# EAGLE design nfc_lock (EAGLE 7.7.0)
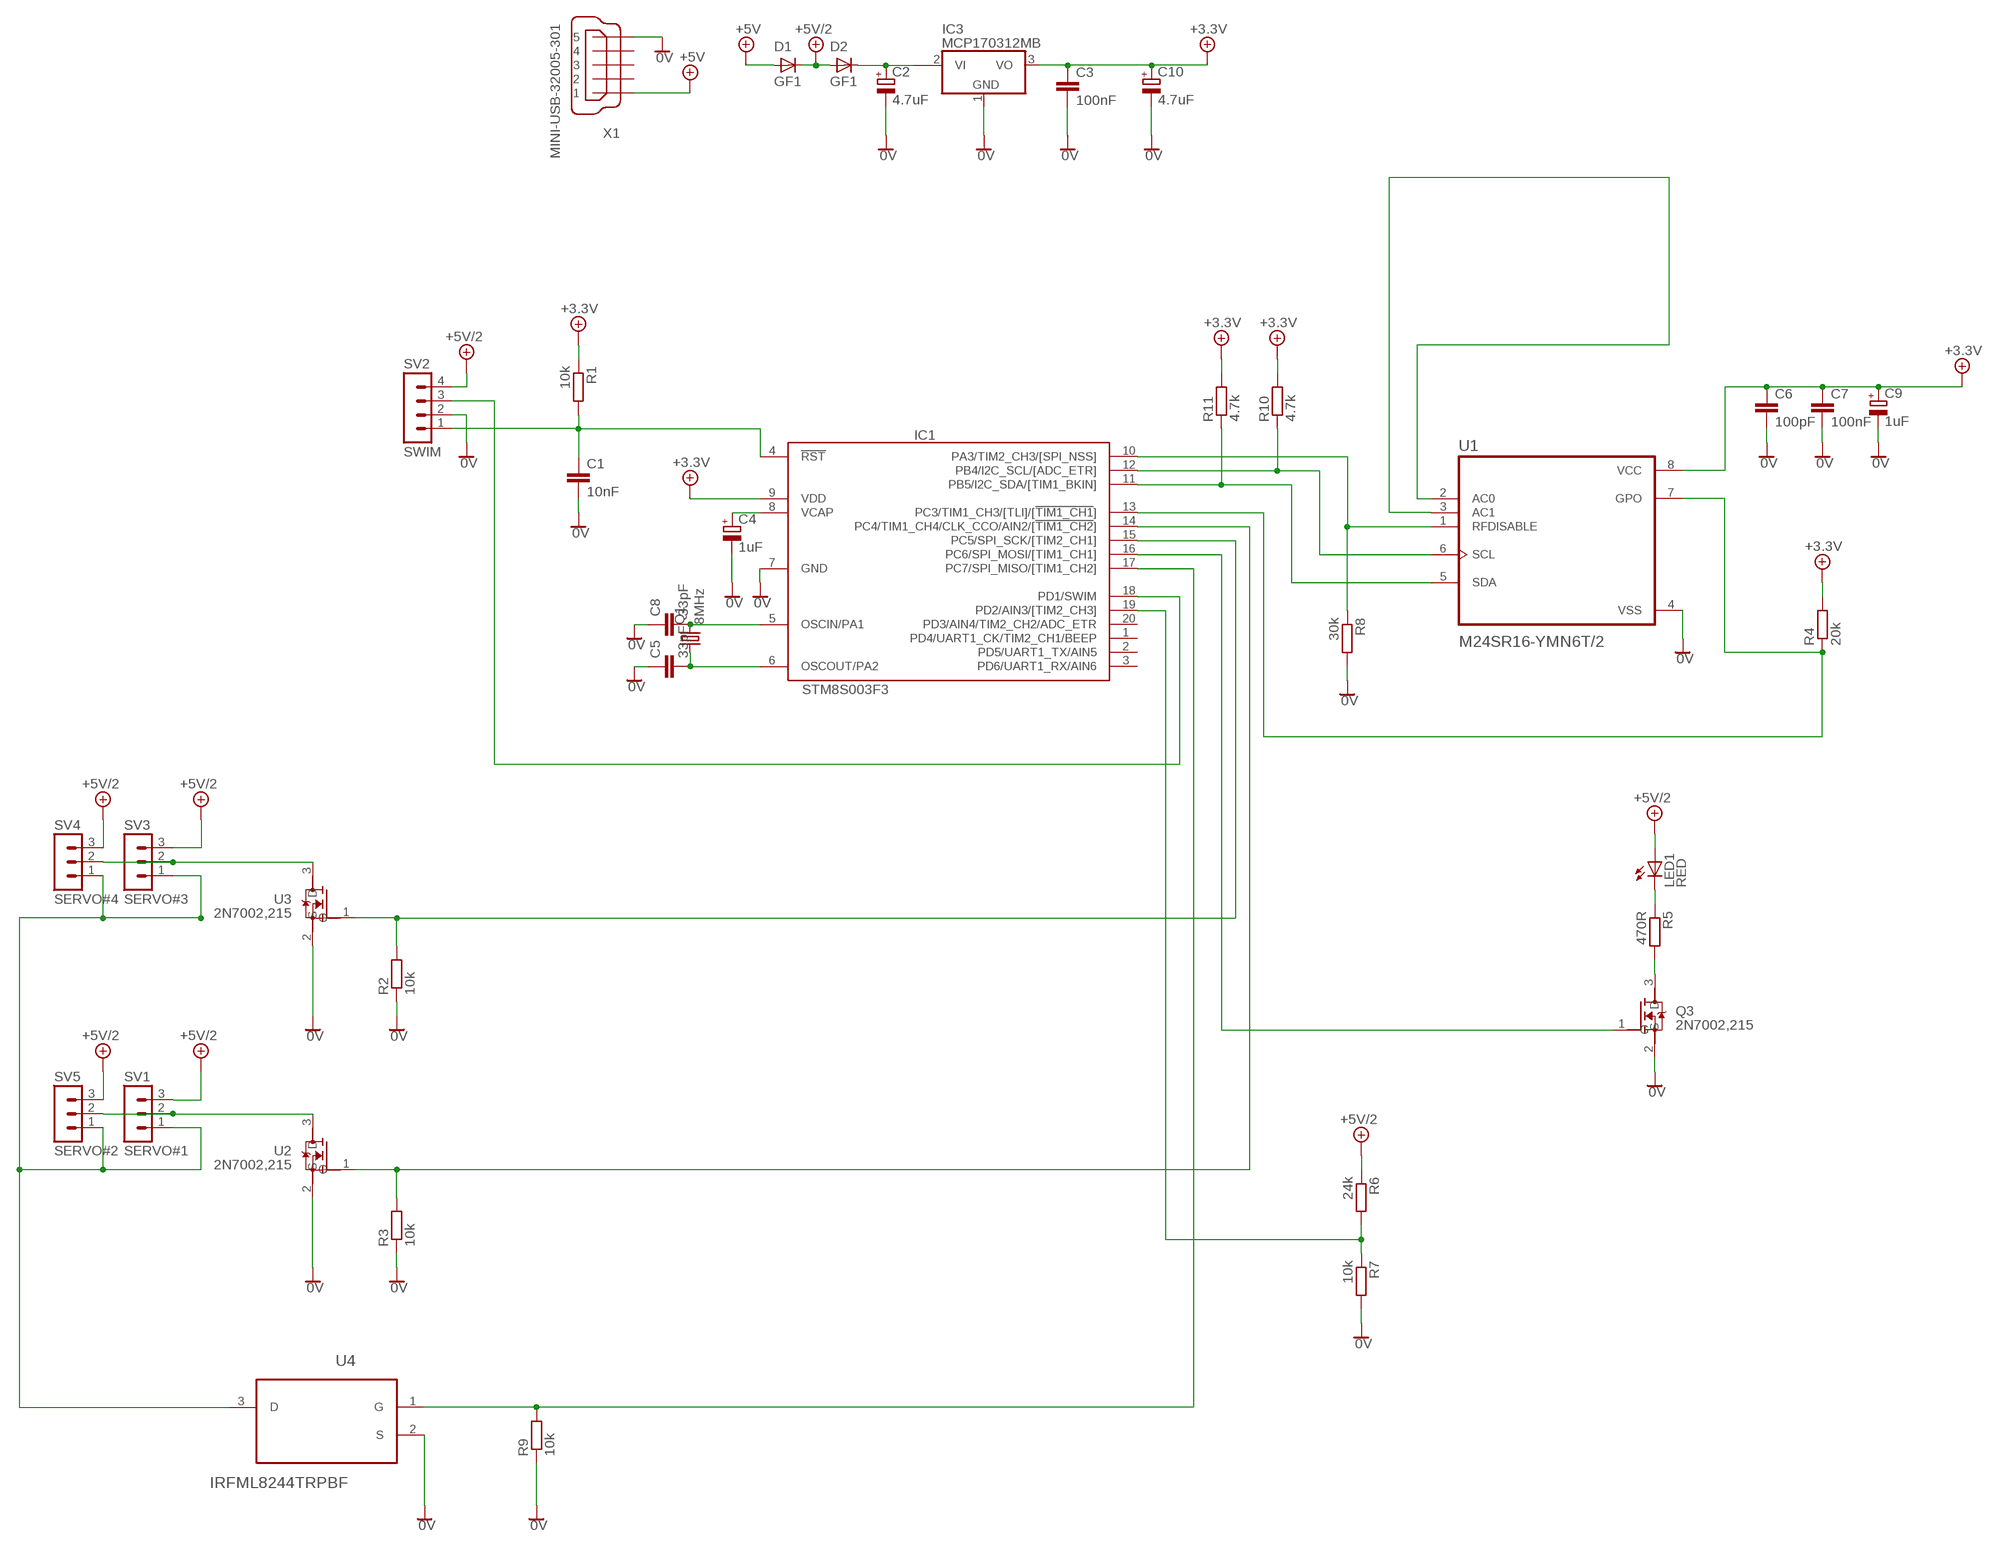
[diagram p0: schematic, sheet 1]

## Parts
C1  10nF  C-EUC0603K  [C0603K]
C2  4.7uF  CPOL-EU153CLV-0405  [153CLV-0405]
C3  100nF  C-EUC1206  [C1206]
C4  1uF  CPOL-EU153CLV-0405  [153CLV-0405]
C5  33pF  C-EUC0603K  [C0603K]
C6  100pF  C-EUC1206  [C1206]
C7  100nF  C-EUC1206  [C1206]
C8  33pF  C-EUC0603K  [C0603K]
C9  1uF  CPOL-EU153CLV-0405  [153CLV-0405]
C10  4.7uF  CPOL-EU153CLV-0405  [153CLV-0405]
D1  GF1  [SMA-DO214AC]
D2  GF1  [SMA-DO214AC]
IC1  STM8S003F3  [TSSOP20]
IC3  MCP170312MB  [SOT89]
LED1  RED  LEDCHIP-LED0603  [CHIP-LED0603]
Q1  8MHz  CRYSTALSM49  [SM49]
Q3  2N7002,215  [SOT95P230X110-3N]
R1  10k  R-EU_R0805  [R0805]
R2  10k  R-EU_R0805  [R0805]
R3  10k  R-EU_R0805  [R0805]
R4  20k  R-EU_R0805  [R0805]
R5  470R  R-EU_R0805  [R0805]
R6  24k  R-EU_R0805  [R0805]
R7  10k  R-EU_R0805  [R0805]
R8  30k  R-EU_R0805  [R0805]
R9  10k  R-EU_R0805  [R0805]
R10  4.7k  R-EU_R0805  [R0805]
R11  4.7k  R-EU_R0805  [R0805]
SV1  SERVO#1  MA03-1  [MA03-1]
SV2  SWIM  MA04-1  [MA04-1]
SV3  SERVO#3  MA03-1  [MA03-1]
SV4  SERVO#4  MA03-1  [MA03-1]
SV5  SERVO#2  MA03-1  [MA03-1]
U1  M24SR16-YMN6T/2  [SOIC127P600X175-8N]
U2  2N7002,215  [SOT95P230X110-3N]
U3  2N7002,215  [SOT95P230X110-3N]
U4  IRFML8244TRPBF  [SOT95P240X112-3N]
X1  MINI-USB-32005-301  [32005-301]

## Nets
0V: C1.2 C2.- C3.2 C4.- C5.1 C6.2 C7.2 C8.1 C9.- C10.- IC1.7(GND) IC3.1(GND) Q3.2(S) R2.1 R3.1 R7.2 R8.2 R9.1 SV2.2 U1.4(VSS) U2.2(S) U3.2(S) U4.2(S) X1.5
+5V: D1.A X1.1
+5V/1: C3.1 C6.1 C7.1 C9.+ C10.+ IC1.9(VDD) IC3.3(VO) R1.1 R4.2 R10.2 R11.2 U1.8(VCC) ; supply symbol labelled +3.3V
+5V/2: D1.K(C) D2.A LED1.A R6.1 SV1.3 SV2.4 SV3.3 SV4.3 SV5.3
ANTENA: U1.2(AC0) U1.3(AC1)
CTRL_LED: IC1.16(PC6/SPI_MOSI/[TIM1_CH1]) Q3.1(G)
N$4: C2.+ D2.K(C) IC3.2@1(VI1)
N$5: C1.1 IC1.4(!RST) R1.2 SV2.1
N$6: IC1.18(PD1/SWIM) SV2.3
N$7: IC1.10(PA3/TIM2_CH3/[SPI_NSS]) R8.1 U1.1(RFDISABLE)
N$8: IC1.13(PC3/TIM1_CH3/[TLI]/[!TIM1_CH1!]) R4.1 U1.7(GPO)
N$9: SV1.2 SV5.2 U2.3(D)
N$11: SV3.2 SV4.2 U3.3(D)
N$12: LED1.C R5.1
N$14: Q3.3(D) R5.2
N$15: C4.+ IC1.8(VCAP)
N$16: C8.2 IC1.5(OSCIN/PA1) Q1.2
N$17: C5.2 IC1.6(OSCOUT/PA2) Q1.1
N$18: IC1.19(PD2/AIN3/[TIM2_CH3]) R6.2 R7.1
SCL: IC1.12(PB4/I2C_SCL/[ADC_ETR]) R10.1 U1.6(SCL)
SDA: IC1.11(PB5/I2C_SDA/[TIM1_BKIN]) R11.1 U1.5(SDA)
SERVO_GND: SV1.1 SV3.1 SV4.1 SV5.1 U4.3(D)
SERVO_PACK_1: IC1.14(PC4/TIM1_CH4/CLK_CCO/AIN2/[!TIM1_CH2!]) R3.2 U2.1(G)
SERVO_PACK_2: IC1.15(PC5/SPI_SCK/[TIM2_CH1]) R2.2 U3.1(G)
SERWO_PWR: IC1.17(PC7/SPI_MISO/[TIM1_CH2]) R9.2 U4.1(G)
Unconnected: IC1.1(PD4/UART1_CK/TIM2_CH1/BEEP) IC1.2(PD5/UART1_TX/AIN5) IC1.3(PD6/UART1_RX/AIN6) IC1.20(PD3/AIN4/TIM2_CH2/ADC_ETR) IC3.2(VI) X1.2 X1.3 X1.4

## Library data of the parts
C1 C3 C5-C8 = rcl:C-EU: CAPACITOR, European symbol
C2 C4 C9 C10 = rcl:CPOL-EU: POLARIZED CAPACITOR, European symbol
D1 D2 = diode:GF1: DIODE
IC1 = stm8:STM8S003: Value line, 16 MHz STM8S 8-bit MCU, 8 Kbytes Flash, 128 bytes data EEPROM, 10-bit ADC, 3 timers, UART, SPI, I2C
IC3 = linear:MCP1703*: 250 mA, 16V, Low Quiescent Current LDO Regulator Source: http://ww1.microchip.com/downloads/en/DeviceDoc/22049b.pdf
LED1 = led:LED: LED OSRAM: - CHIPLED LG R971, LG N971, LY N971, LG Q971, LY Q971, LO R971, LY R971 LH N974, LH R974 LS Q976, LO Q976, LY Q976 LO Q996 - Hyper CHIPLED LW Q18S LB Q993, LB Q99A, LB R99A - SideLED LS A670, LO A670, LY A670, LG A670, LP A670 LB A673, LV A673, LT A673, LW A673 LH A674 LY A675 LS A676, LA A676, LO A676, LY A676, LW A676 LS A679, LY A679, LG A679 - Hyper Micro SIDELED® LS Y876, LA Y876, LO Y876, LY Y876 LT Y87S - SmartLED LW L88C, LW L88S LB L89C, LB L89S, LG L890 LS L89K, LO L89K, LY L89K LS L896, LA L896, LO L896, LY L896 - TOPLED LS T670, LO T670, LY T670, LG T670, LP T670 LSG T670, LSP T670, LSY T670, LOP T670, LYG T670 LG T671, LOG T671, LSG T671 LB T673, LV T673, LT T673, LW T673 LH T674 LS T676, LA T676, LO T676, LY T676, LB T676, LH T676, LSB T676, LW T676 LB T67C, LV T67C, LT T67C, LS T67K, LO T67K, LY T67K, LW E67C LS E67B, LA E67B, LO E67B, LY E67B, LB E67C, LV E67C, LT E67C LW T67C LS T679, LY T679, LG T679 LS T770, LO T770, LY T770, LG T770, LP T770 LB T773, LV T773, LT T773, LW T773 LH T774 LS E675, LA E675, LY E675, LS T675 LS T776, LA T776, LO T776, LY T776, LB T776 LHGB T686 LT T68C, LB T68C - Hyper Mini TOPLED® LB M676 - Mini TOPLED Santana® LG M470 LS M47K, LO M47K, LY M47K Source: http://www.osram.convergy.de LUXEON: - LUMILED® LXK2-PW12-R00, LXK2-PW12-S00, LXK2-PW14-U00, LXK2-PW14-V00 LXK2-PM12-R00, LXK2-PM12-S00, LXK2-PM14-U00 LXK2-PE12-Q00, LXK2-PE12-R00, LXK2-PE12-S00, LXK2-PE14-T00, LXK2-PE14-U00 LXK2-PB12-K00, LXK2-PB12-L00, LXK2-PB12-M00, LXK2-PB14-N00, LXK2-PB14-P00, LXK2-PB14-Q00 LXK2-PR12-L00, LXK2-PR12-M00, LXK2-PR14-Q00, LXK2-PR14-R00 LXK2-PD12-Q00, LXK2-PD12-R00, LXK2-PD12-S00 LXK2-PH12-R00, LXK2-PH12-S00 LXK2-PL12-P00, LXK2-PL12-Q00, LXK2-PL12-R00 Source: www.luxeon.com KINGBRIGHT: KA-3528ASYC Source: www.kingbright.com
Q1 = crystal:CRYSTAL: CRYSTAL; OC_FARNELL: unknown; OC_NEWARK: unknown
Q3 U2 U3 = Common-Parts-Library-Eagle:2N7002,215: 2N7002 Series N-Channel 60 V 5 O 0.83 W TrenchMOS FET - SOT-23-3; MANUFACTURER: NXP Semiconductor
R1-R11 = rcl:R-EU_: RESISTOR, European symbol
SV1 SV3-SV5 = con-lstb:MA03-1: PIN HEADER; OC_FARNELL: unknown; OC_NEWARK: unknown
SV2 = con-lstb:MA04-1: PIN HEADER; OC_FARNELL: unknown; OC_NEWARK: unknown
U1 = m24sr16-ymn6t_2:M24SR16-YMN6T/2: None; AVAILABILITY: Good; DESCRIPTION: NFC/RFID Tag and Transponder Chip 13553kHz to 13567kHz 16Kbit 8-Pin SO N Tape and Reel; MF: STMicroelectronics; MP: M24SR16-YMN6T/2; PACKAGE: SO-8 STMicroelectronics; PRICE: 0.81 USD
U4 = irfml8244trpbf:IRFML8244TRPBF: Power MOSFET; MPN: IRFML8244TRPBF; OC_FARNELL: 1857298; OC_NEWARK: 25T5496; PACKAGE: SOT-23-3; SUPPLIER: INTERNATIONAL RECTIFIER
X1 = con-cypressindustries:MINI-USB-: MINI USB-B Conector Source: www.cypressindustries.com; OC_FARNELL: unknown; OC_NEWARK: unknown

## Board
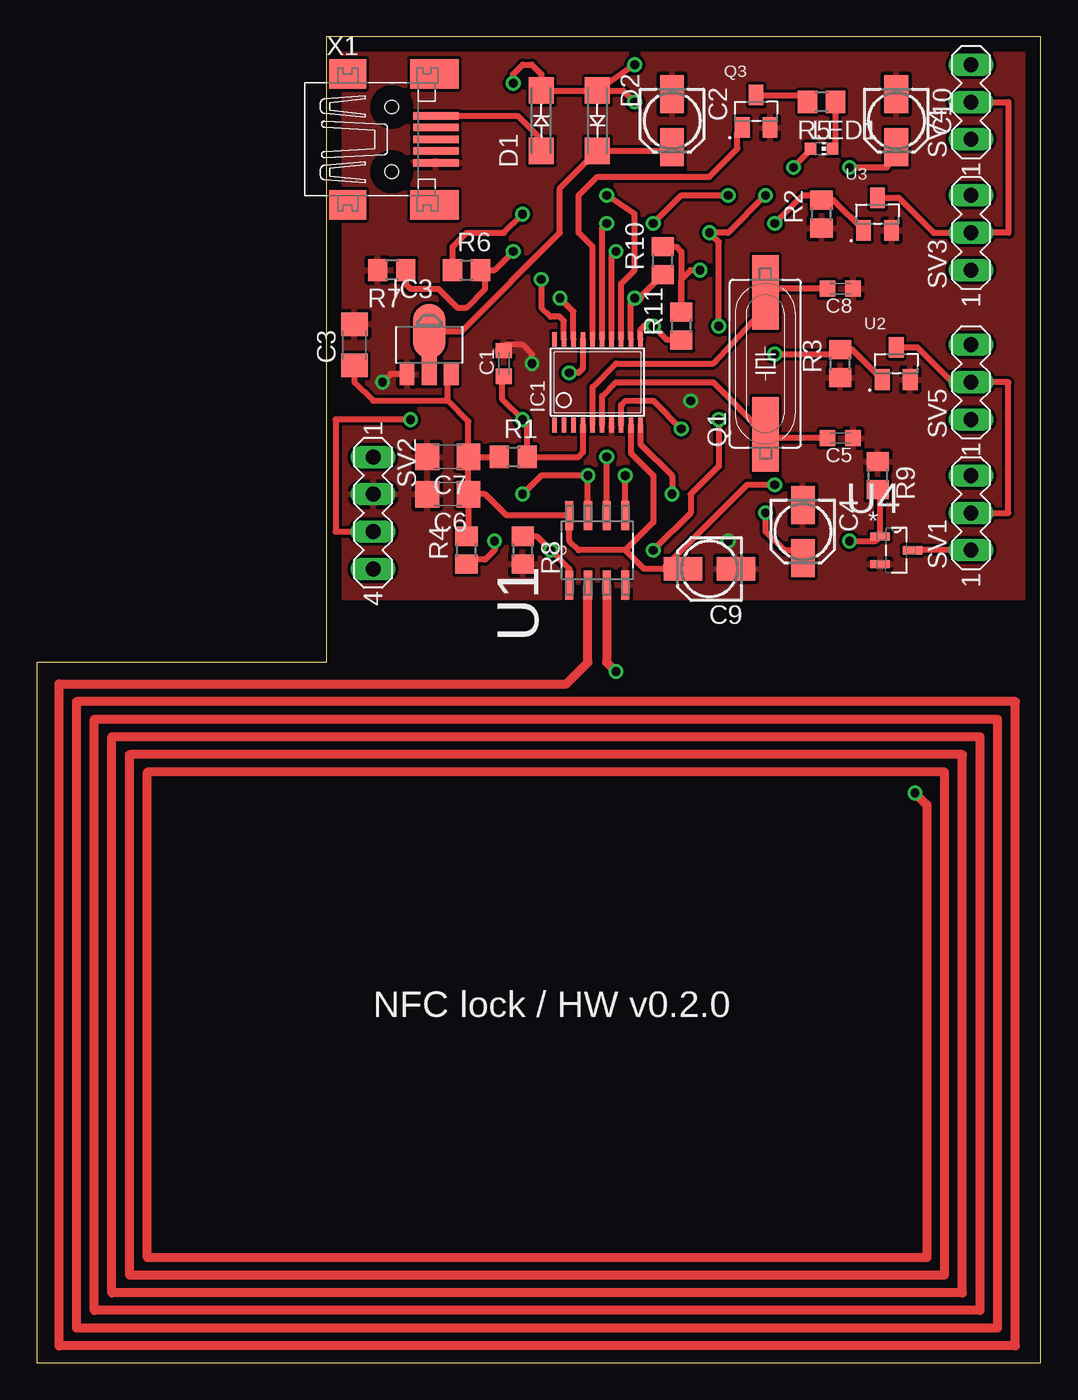
[diagram p1: board, top side]
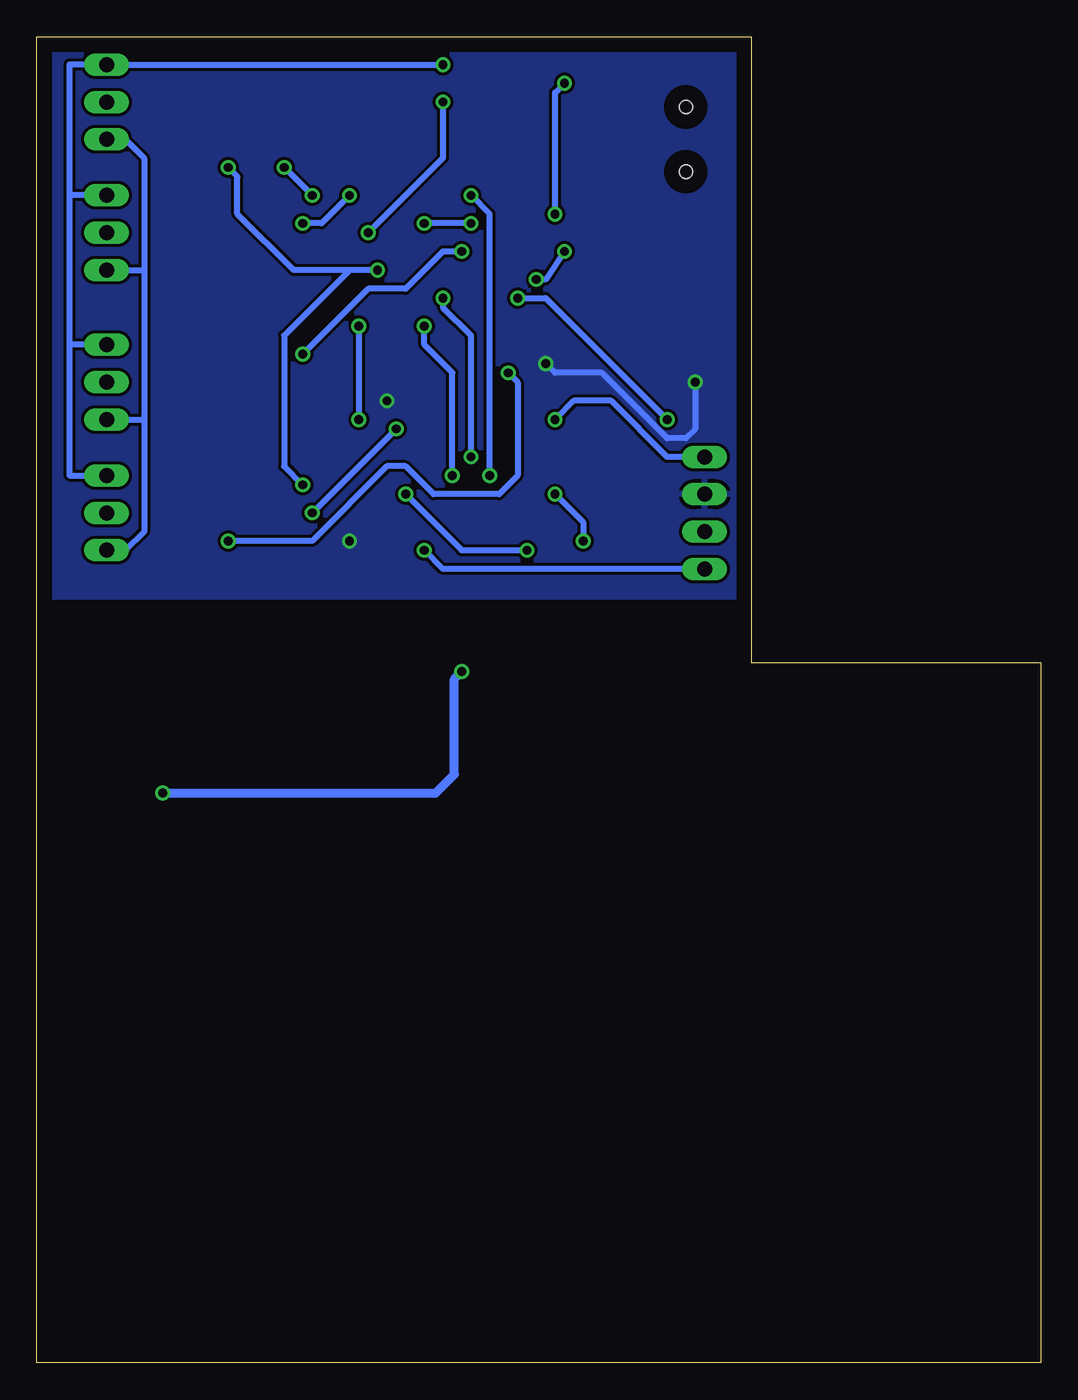
[diagram p2: board, bottom side, seen from below]

Size 68.25 x 90.16 mm. Coordinates in mm from the lower left corner, seen from the top.
Outline: 0,0 68.25,0 68.25,90.16 19.69,90.16 19.69,47.62 0,47.62 0,0
Copper layers (1*16): Top 0.035mm / dielectric 1.5mm / Bottom 0.035mm
Design rules "default": minimum track width 10mil, minimum drill 24mil, track to track 8mil, track to pad 8mil, pad to pad 8mil, via to via 8mil, smd to smd 8mil, copper to edge 40mil, drill to drill 8mil, minimum pad ring 10mil, minimum via ring 8mil, stop-mask expansion 4mil, vias tented up to drill 0mil, thermal gap 10mil

### Footprints (pad centres in the part's own frame; a part is rotated, then mirrored left to right if it is on the bottom)
C0603K = smd 1.05 x 1.08: 1 -0.875,0; 2 0.875,0
153CLV-0405 = smd 2.6 x 1.6: + 1.8,0; - -1.8,0
C1206 = smd 1.6 x 1.8: 1 -1.4,0; 2 1.4,0
SMA-DO214AC = smd 1.8 x 1.7: A -2.05,0; K 2.05,0
TSSOP20 = smd 0.305 x 0.991: 1 -2.925,-2.918; 2 -2.275,-2.918; 3 -1.625,-2.918; 4 -0.975,-2.918; 5 -0.325,-2.918; 6 0.325,-2.918; 7 0.975,-2.918; 8 1.625,-2.918; 9 2.275,-2.918; 10 2.925,-2.918; 11 2.925,2.918; 12 2.275,2.918; 13 1.625,2.918; 14 0.975,2.918; 15 0.325,2.918; 16 -0.325,2.918; 17 -0.975,2.918; 18 -1.625,2.918; 19 -2.275,2.918; 20 -2.925,2.918
SOT89 = smd 1 x 1.5: 1 -1.499,-1.981; 3 1.499,-1.981 | smd 1 x 2: 2 0,-1.727 | smd 2.2 x 3.7: 2@1 0,0.94
CHIP-LED0603 = smd 0.8 x 0.8: A 0,-0.75; C 0,0.75
SM49 = smd 5.08 x 1.778: 1 -4.826,0; 2 4.826,0
SOT95P230X110-3N = smd 1 x 1.4: 1 -0.95,-1.1; 2 0.95,-1.1; 3 0,1.1
R0805 = smd 1.3 x 1.5: 1 -0.95,0; 2 0.95,0
MA03-1 = drill 1.016 long: 1 -2.54,0; 2 0,0; 3 2.54,0
MA04-1 = drill 1.016 long: 1 -3.81,0; 2 -1.27,0; 3 1.27,0; 4 3.81,0
SOIC127P600X175-8N = smd 1.981 x 0.559: 1 -2.362,1.905; 2 -2.362,0.635; 3 -2.362,-0.635; 4 -2.362,-1.905; 5 2.362,-1.905; 6 2.362,-0.635; 7 2.362,0.635; 8 2.362,1.905
SOT95P240X112-3N = smd 1.321 x 0.559: 1 -1.092,0.94; 2 -1.092,-0.94; 3 1.092,0
32005-301 = smd 3.1 x 0.5: 1 3,1.6; 2 3,0.8; 3 3,0; 4 3,-0.8; 5 3,-1.6 | smd 2.5 x 2: M1 -3,-4.45; M2 -3,4.45 | smd 3.3 x 2: M3 2.9,4.45; M4 2.9,-4.45 | hole 0.9: 0,2.2; 0,-2.2

### Placement (x,y rotation side)
C1  31.75,67.94 90 top
C2  43.18,84.46 270 top
C3  21.59,69.22 90 top
C4  52.07,56.52 270 top
C5  54.61,62.87 180 top
C6  27.94,59.05 180 top
C7  27.94,61.59 180 top
C8  54.61,73.03 180 top
C9  45.72,53.98 180 top
C10  58.42,84.46 270 top
D1  34.29,84.46 90 top
D2  38.1,84.46 270 top
IC1  38.1,66.68 0 top
IC3  26.67,69.22 0 top
LED1  53.34,82.55 270 top
Q1  49.53,67.94 90 top
Q3  48.89,85.09 0 top
R1  32.38,61.59 0 top
R2  53.34,78.1 90 top
R3  54.61,67.94 90 top
R4  29.21,55.24 90 top
R5  53.34,85.72 180 top
R6  29.21,74.3 0 top
R7  24.13,74.3 180 top
R8  33.02,55.24 270 top
R9  57.15,60.33 270 top
R10  42.55,74.93 90 top
R11  43.81,70.48 90 top
SV1  63.5,57.79 90 top
SV2  22.86,57.79 270 top
SV3  63.5,76.84 90 top
SV4  63.5,85.72 90 top
SV5  63.5,66.68 90 top
U1  38.1,55.24 90 top
U2  58.42,67.94 0 top
U3  57.15,78.1 0 top
U4  58.42,55.24 0 top
X1  24.13,83.19 0 top

### Tracks (layer width: path | path; a pad name or v marks a point on that pad's centre or on a via)
0V  (via drill 0.6)
  Top 0.406: IC3.1 24.05,67.23 v23.49,66.68 | v33.66,67.94 33.66,68.58 33.02,69.22 31.88,69.22 C1.2
  Bottom 0.406: v23.49,66.68 23.49,63.5 24.13,62.87 25.4,62.87 29.84,67.31 33.02,67.31 v33.66,67.94
  other vias: 46.99,55.88 44.45,65.41
  pour Top: 20.32,89.53 20.32,52.07 67.31,52.07 67.31,89.53
  pour Bottom: 20.32,89.53 20.32,52.07 67.31,52.07 67.31,89.53
+5V
  Top 0.406: X1.1 32.69,84.78 34.29,83.19 D1.A
+5V/1  (via drill 0.6)
  Top 0.406: C3.1 21.59,66.68 22.86,65.41 27.94,65.41 | 27.94,65.41 27.94,67 IC3.3 | IC1.9 40.38,61.86 41.91,60.33 41.91,57.15 40,55.24 | 40,55.24 36.83,55.24 36.2,55.88 U1.8 31.93,57.61 30.48,59.05 C6.1 | R10.2 43.5,75.88 43.81,75.56 R11.2 43.81,73.66 44.45,74.3 v45.09,74.3 | v50.16,59.69 48.26,59.69 42.55,53.98 | 42.55,53.98 41.27,53.98 40,55.24 | 42.55,53.98 C9.+ | C6.1 29.34,56.33 R4.2 | C6.1 C7.1 | C7.1 R1.1 | C7.1 29.34,64 27.94,65.41 | v55.24,81.28 57.79,81.28 58.42,81.91 C10.+
  Bottom 0.406: v45.09,74.3 46.99,74.3 | 46.99,74.3 51.43,69.85 51.43,60.96 v50.16,59.69 | 46.99,74.3 50.8,74.3 54.61,78.1 54.61,80.65 v55.24,81.28
+5V/2  (via drill 0.6)
  Top 0.406: D2.A D1.K 34.29,87.63 33.66,88.27 33.02,88.27 32.38,87.63 v32.38,87 | v40.64,88.27 D2.A | D2.A 39.86,86.5 v40.64,85.72 | v46.35,64.13 46.35,60.96 44.45,59.05 44.45,57.79 v41.91,55.24 | LED1.A 52.59,82.44 v51.43,81.28 | v46.35,70.48 46.35,76.2 v45.72,76.84 46.99,76.84 v49.53,79.38 | R6.1 28.26,75.88 29.21,76.84 31.75,76.84 v33.02,78.1
  Bottom 0.406: v40.64,88.27 SV4.3 66.04,88.27 66.04,79.38 | SV3.3 66.04,79.38 | 66.04,79.38 66.04,69.22 | SV5.3 66.04,69.22 | 66.04,69.22 66.04,60.33 SV1.3 | v40.64,85.72 40.64,81.91 v45.72,76.84 | v46.35,70.48 v46.35,64.13 | SV2.4 40.64,53.98 v41.91,55.24 | v33.02,78.1 33.02,86.36 v32.38,87 | v51.43,81.28 v49.53,79.38
ANTENA  (via drill 0.6)
  Top 0.406: 60.51,37.94 60.49,37.94
  Top 0.61: 60.51,37.94 60.51,7.15 7.51,7.15 7.51,40.15 61.71,40.15 61.71,5.95 6.31,5.95 6.31,41.35 62.91,41.35 62.91,4.75 5.11,4.75 5.11,42.55 64.11,42.55 64.11,3.55 3.91,3.55 3.91,43.75 65.31,43.75 65.31,2.35 2.71,2.35 2.71,44.95 66.51,44.95 66.51,1.15 1.51,1.15 1.51,46.15 35.99,46.15 37.46,47.62 U1.2 | 59.79,38.65 59.78,38.65 v59.69,38.73 60.49,37.94 | U1.3 38.73,47.62 v39.37,46.99
  Bottom 0.61: v39.37,46.99 39.87,46.49 39.87,40.01 41.14,38.73 v59.69,38.73
CTRL_LED
  Top 0.406: IC1.16 37.77,75.89 36.83,76.84 36.83,79.38 38.1,80.65 45.72,80.65 47.62,82.55 47.62,83.67 Q3.1
N$4
  Top 0.406: C2.+ 42.93,82.41 D2.K 35.56,79.87 35.56,76.84 28.88,70.16 IC3.2@1
N$5  (via drill 0.6)
  Top 0.406: C1.1 31.62,66.68 31.62,65.53 v33.02,64.13 33.34,63.82 R1.2 36.83,61.59 37.12,61.89 IC1.4
  Bottom 0.406: SV2.1 25.4,61.59 29.21,65.41 31.75,65.41 v33.02,64.13
N$6  (via drill 0.6)
  Top 0.406: IC1.18 36.48,71.47 v35.56,72.39 | v25.4,64.13 20.32,64.13 20.32,56.52 SV2.3
  Bottom 0.406: v35.56,72.39 33.66,72.39 v25.4,64.13
N$7  (via drill 0.6)
  Top 0.406: v43.18,59.05 43.18,60.33 41.02,62.48 IC1.10 | U1.1 36.2,53.98 v34.92,55.24 33.98,56.2 R8.1
  Bottom 0.406: v43.18,59.05 39.37,55.24 v34.92,55.24
N$8  (via drill 0.6)
  Top 0.406: U1.7 v37.46,60.33 34.29,60.33 v33.02,59.05 | IC1.13 39.73,73.38 40.64,74.3 40.64,78.1 v38.73,79.38 | v31.12,55.88 31.12,55.24 30.48,54.61 29.52,54.61 R4.1
  Bottom 0.406: v37.46,60.33 37.46,78.1 v38.73,79.38 | v33.02,59.05 31.12,57.15 v31.12,55.88
N$9
  Top 0.406: SV1.2 66.04,57.79 66.04,66.68 SV5.2 62.23,66.68 59.86,69.05 U2.3
N$11
  Top 0.406: SV4.2 66.04,85.72 66.04,76.84 SV3.2 60.96,76.84 58.59,79.21 U3.3
N$12
  Top 0.406: R5.1 54.29,82.75 LED1.C
N$14
  Top 0.406: 52.09,86.03 R5.2 51.92,86.19 Q3.3
N$15  (via drill 0.6)
  Top 0.406: IC1.8 39.73,65.12 40,65.41 41.91,65.41 v43.81,63.5 | v49.53,57.79 49.53,56.52 50.8,55.24 51.54,55.24 C4.+
  Bottom 0.406: v43.81,63.5 v49.53,57.79
N$16
  Top 0.406: IC1.5 37.77,66.35 39.37,67.94 45.97,67.94 49.53,71.75 Q1.2 49.78,73.03 C8.2
N$17
  Top 0.406: IC1.6 38.42,65.73 39.37,66.68 45.97,66.68 Q1.1 49.78,62.87 C5.2
N$18  (via drill 0.6)
  Top 0.406: R7.1 25.08,73.34 25.4,73.03 27.3,73.03 28.57,71.75 29.21,71.75 30.48,73.03 30.48,73.97 R6.2 31.12,74.3 v32.38,75.56 | v34.29,73.66 34.29,71.75 34.92,71.12 35.56,71.12 35.82,70.86 IC1.19
  Bottom 0.406: v32.38,75.56 33.66,73.66 v34.29,73.66
SCL  (via drill 0.6)
  Top 0.406: IC1.12 40.38,72.12 v40.64,72.39 | U1.6 v38.73,61.59 | 40.95,72.39 R10.1
  Top 0.61: v40.64,72.39 40.95,72.39
  Bottom 0.406: v40.64,72.39 40.64,71.75 38.73,69.85 v38.73,61.59
SDA  (via drill 0.6)
  Top 0.406: U1.5 v40,60.33 | IC1.11 41.02,70.23 41.27,70.48 v41.91,70.48 42.86,69.53 R11.1
  Bottom 0.406: v40,60.33 40,67.31 41.91,69.22 v41.91,70.48
SERVO_GND
  Top 0.406: SV1.1 U4.3
  Bottom 0.406: SV4.1 62.23,83.19 60.96,81.91 60.96,74.3 | SV3.1 60.96,74.3 | 60.96,74.3 60.96,64.13 | SV5.1 60.96,64.13 | 60.96,64.13 60.96,56.52 62.23,55.24 SV1.1
SERVO_PACK_1  (via drill 0.6)
  Top 0.406: IC1.14 39.07,75.27 v39.37,75.56 | v50.16,68.58 54.3,68.58 R3.2 55.42,68.9 U2.1
  Bottom 0.406: v39.37,75.56 40.64,75.56 43.18,73.03 45.72,73.03 v50.16,68.58
SERVO_PACK_2  (via drill 0.6)
  Top 0.406: v41.91,77.47 43.81,79.38 v46.99,79.38 | IC1.15 38.42,77.16 v38.73,77.47 | v50.16,77.47 52.07,79.38 53.02,79.38 R2.2 54.15,79.06 U3.1
  Bottom 0.406: v38.73,77.47 v41.91,77.47 | v46.99,79.38 48.89,77.47 v50.16,77.47
SERWO_PWR  (via drill 0.6)
  Top 0.406: R9.2 57.33,59.2 U4.1 57.02,55.88 v55.24,55.88 | IC1.17 37.12,67.61 36.83,67.31 v36.2,67.31
  Bottom 0.406: v36.2,67.31 35.56,66.68 35.56,60.33 36.83,59.05 41.27,59.05 43.18,60.96 44.45,60.96 49.53,55.88 v55.24,55.88

### Text on the board
tNames: NFC lock / HW v0.2.0